# Altium project Papilio_DUO.PrjPcb
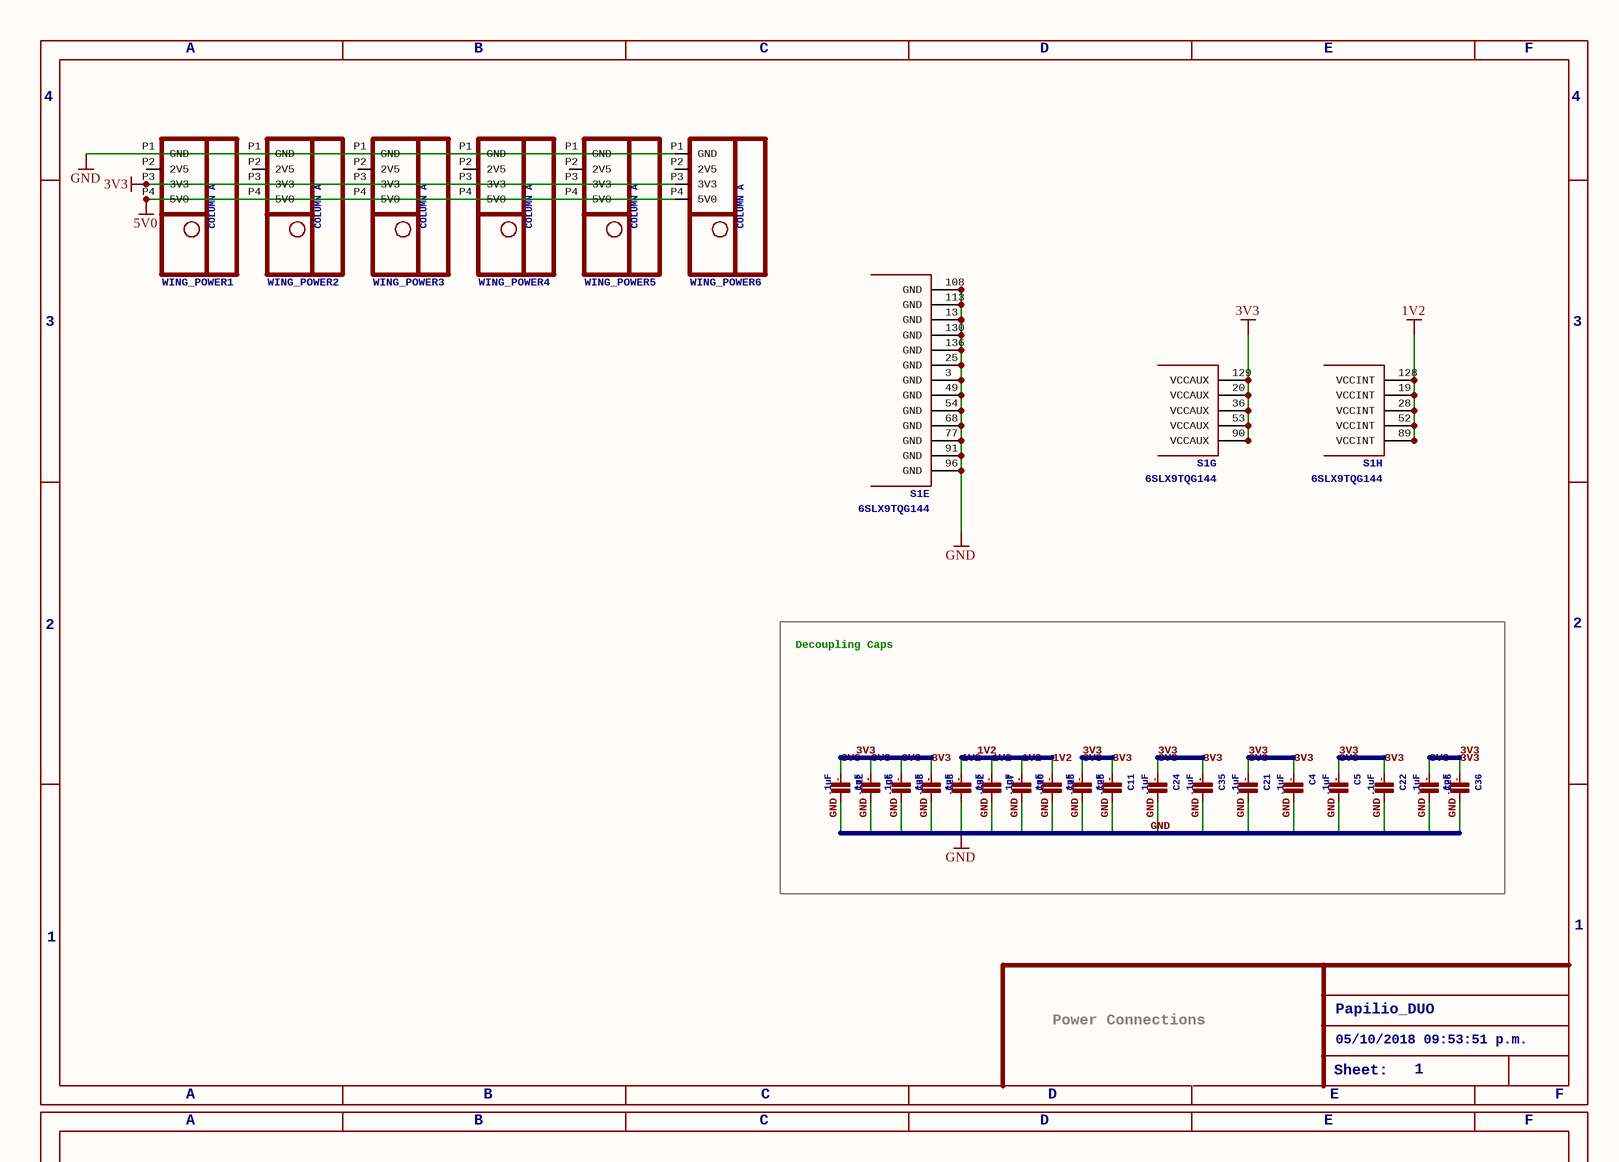
[diagram p0: Papilio_DUO_0.SchDoc, top left]
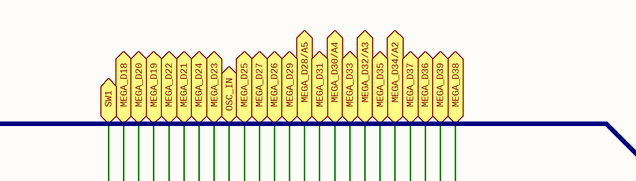
[diagram p1: Papilio_DUO_0.SchDoc, top middle]
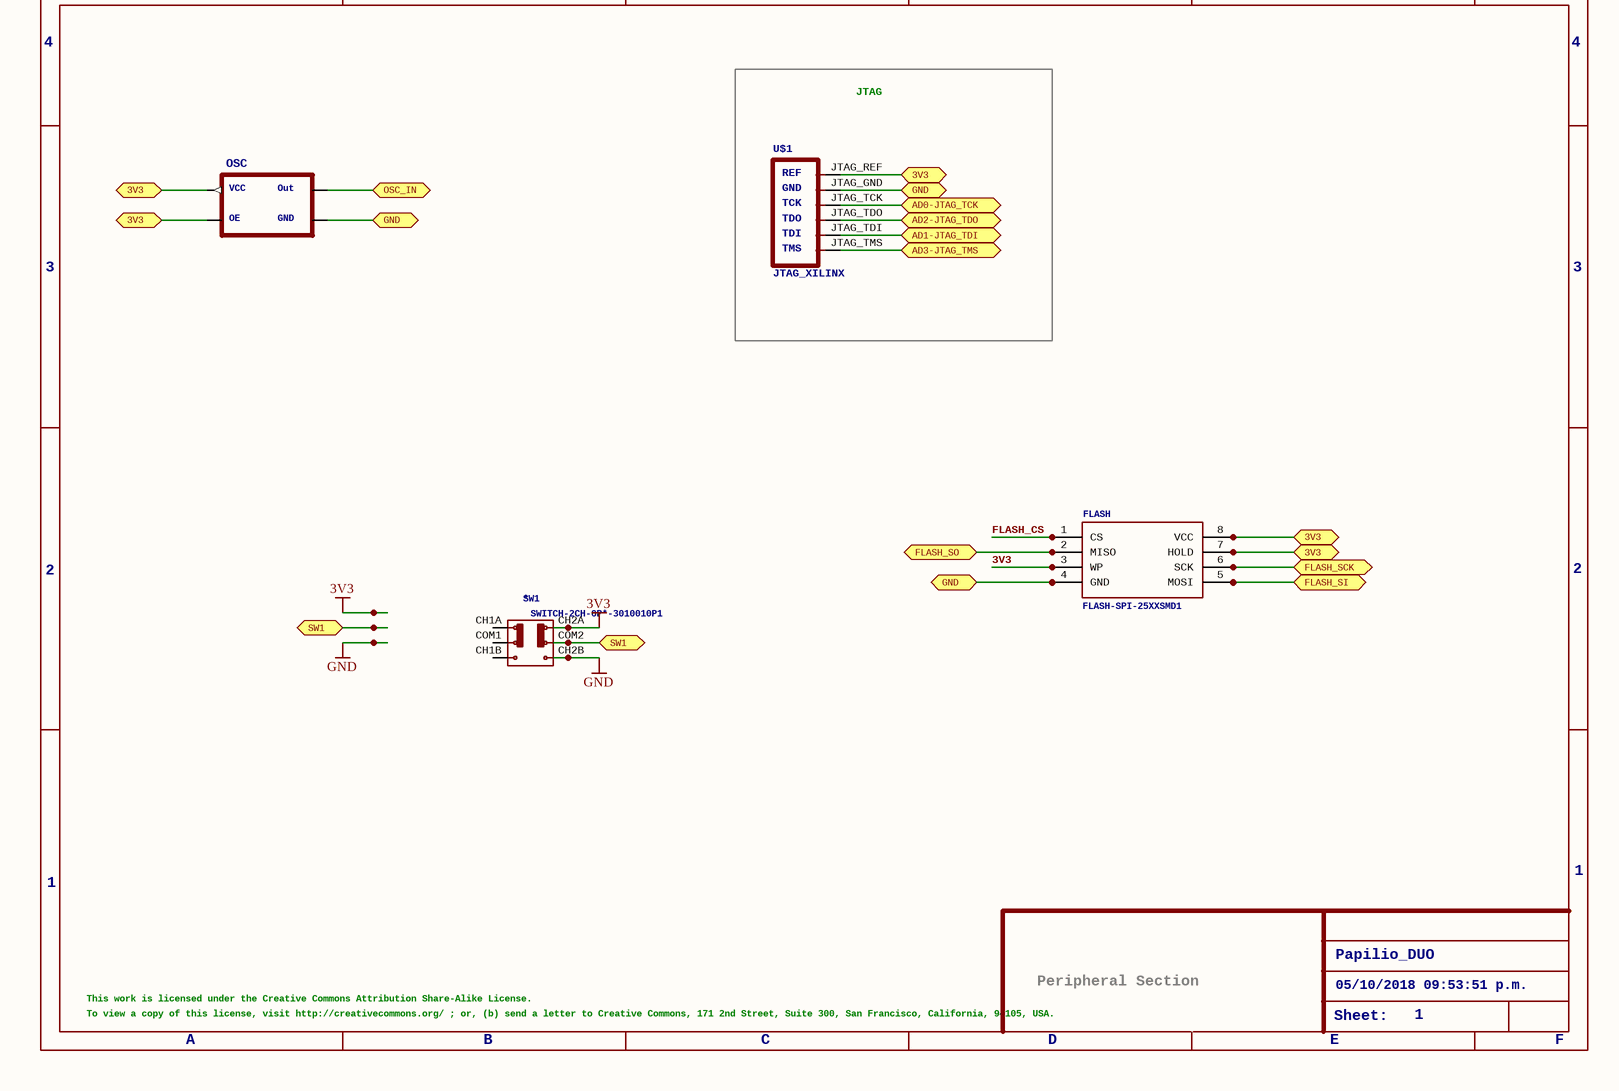
[diagram p2: Papilio_DUO_0.SchDoc, bottom left]
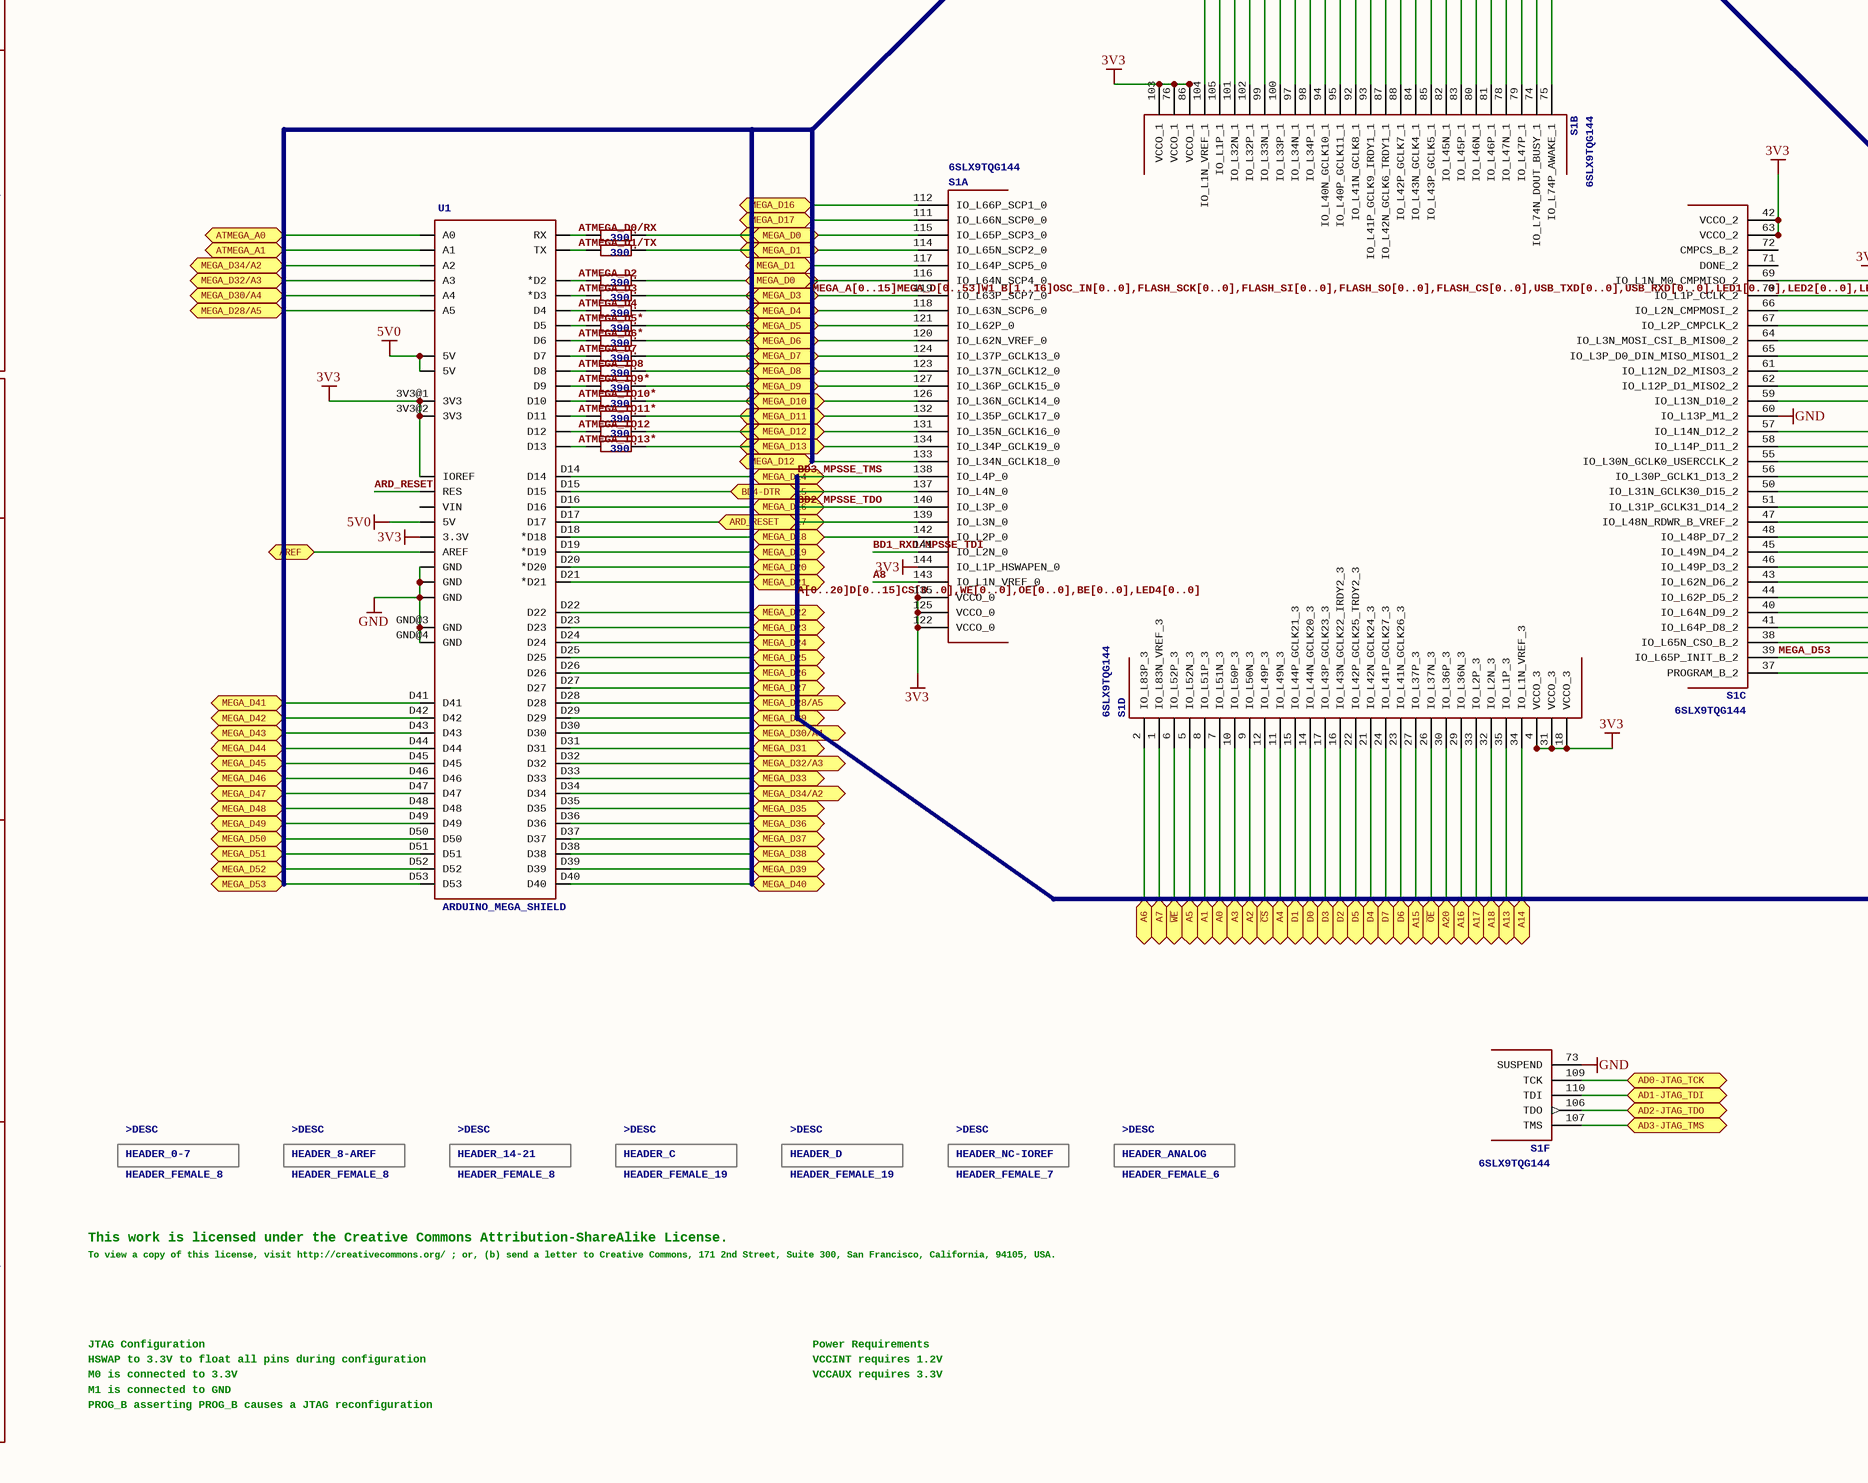
[diagram p3: Papilio_DUO_0.SchDoc, bottom middle]
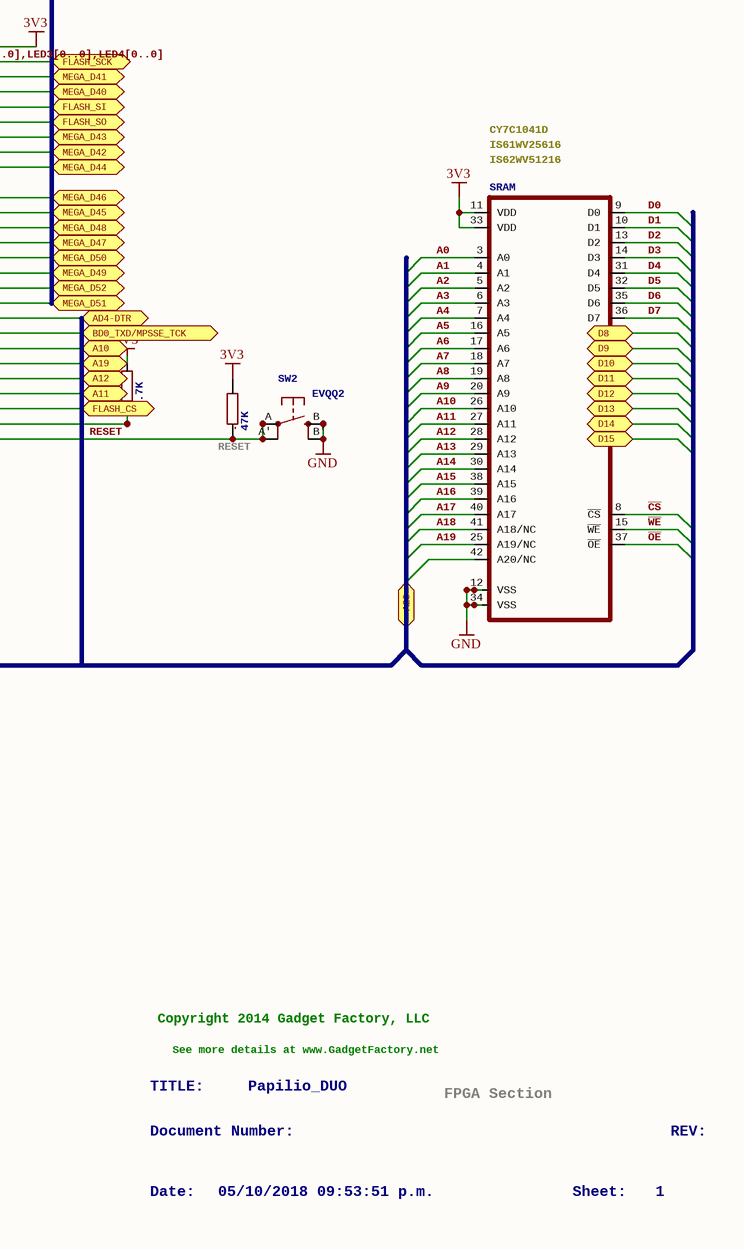
[diagram p4: Papilio_DUO_0.SchDoc, bottom right]
4 sheets, 121 parts. Net scope: flat (ports and power ports of the same name join across sheets).
Board file: Papilio_DUO.PcbDoc
Sheets:
  Papilio_DUO_0.SchDoc
  Papilio_DUO_1.SchDoc
  Papilio_DUO_2.SchDoc
  Papilio_DUO_3.SchDoc

## Sheet Papilio_DUO_0.SchDoc: Papilio_DUO
size 720 x 381 mm; Date: 05/10/2018 09:53:51 p.m.; Organization: INVAP S.E.; Address1: Argentina; Address2: Rio Negro; Address3: Bariloche; Address4: Cte. Luis Piedra Buena 4950; SheetNumber: 1; DATABASE: C:/Dropbox/GadgetFactory/GadgetFactory_Engineering/Libraries/GadgetFactory-PARTSDB.txt; Rule: PcbType=ProtelPcb

### Parts
C4  .1uF  [0603]
C5  .1uF  [0603]
C6  .1uF  [0603]
C7  .1uF  [0603]
C10  .1uF  [0603]
C11  .1uF  [0603]
C12  .1uF  [0603]
C13  .1uF  [0603]
C21  .1uF  [0603]
C22  .1uF  [0603]
C23  .1uF  [0603]
C24  .1uF  [0603]
C25  .1uF  [0603]
C26  .1uF  [0603]
C32  .1uF  [0603]
C33  .1uF  [0603]
C35  .1uF  [0603]
C36  .1uF  [0603]
FLASH  FLASH-SPI-25XXSMD1  [SO08-EIAJ]
FRAME2  DRAWING_NAME: Papilio_DUO  LAST_DATE_TIME: 05/10/2018 09:53:51 p.m.  SHEET: 1  Sheet: Sheet:  (hidden comment: FRAME-A4L-LOC)
FRAME4  DRAWING_NAME: Papilio_DUO  LAST_DATE_TIME: 05/10/2018 09:53:51 p.m.  SHEET: 1  Sheet: Sheet:  (hidden comment: FRAME-A4L-LOC)
HEADER_0-7  HEADER_FEMALE_8  DESC: >DESC
HEADER_8-AREF  HEADER_FEMALE_8  DESC: >DESC
HEADER_14-21  HEADER_FEMALE_8  DESC: >DESC
HEADER_ANALOG  HEADER_FEMALE_6  DESC: >DESC
HEADER_C  HEADER_FEMALE_19  DESC: >DESC
HEADER_D  HEADER_FEMALE_19  DESC: >DESC
HEADER_NC-IOREF  HEADER_FEMALE_7  DESC: >DESC
OSC  OSC1  [OSC1]  (value not drawn)
R8  390  [0603]
R9  390  [0603]
R10  390  [0603]
R11  390  [0603]
R12  390  [0603]
R13  390  [0603]
R14  390  [0603]
R15  390  [0603]
R16  390  [0603]
R17  390  [0603]
R18  390  [0603]
R19  390  [0603]
R20  390  [0603]
R21  390  [0603]
R31  47K  [0805]
R32  4.7K  [0603]
S1  6SLX9TQG144  [TQ144]  (parts A,B,C,D,E,F,G,H of 8)
SRAM  ISSI_SRAM_8BIT  [TSOP44-II]  (value not drawn)
SW1  SWITCH-2CH-6P*-3010010P1  [6P-2CH-2.54-9.1X3.5X3.2+2H]
SW2  EVQQ2  [EVQ-Q2]
U1  ARDUINO_MEGA_SHIELD  [ARDUINO_MEGA_SHIELD]
U$1  JTAG_XILINX  [JTAG]
WING_POWER1  COLUMNA: COLUMN A  [POWER_NO_TEXT]  (hidden comment: HEADER_FEMALE_4)
WING_POWER2  COLUMNA: COLUMN A  [POWER_NO_TEXT]  (hidden comment: HEADER_FEMALE_4)
WING_POWER3  COLUMNA: COLUMN A  [POWER_NO_TEXT]  (hidden comment: HEADER_FEMALE_4)
WING_POWER4  COLUMNA: COLUMN A  [POWER_NO_TEXT]  (hidden comment: HEADER_FEMALE_4)
WING_POWER5  COLUMNA: COLUMN A  [POWER_NO_TEXT]  (hidden comment: HEADER_FEMALE_4)
WING_POWER6  COLUMNA: COLUMN A  [POWER_NO_TEXT]  (hidden comment: HEADER_FEMALE_4)

### Blocks framed on the sheet
Decoupling Caps: C4-C7 C10-C13 C21-C26 C32 C33 C35 C36
JTAG: U$1

### Ports
3V3, A0, A1, A2, A3, A4, A5, A6, A7, A9, A10, A11, A12, A13, A14, A15, A16, A17, A18, A19, A20, AD0-JTAG_TCK, AD1-JTAG_TDI, AD2-JTAG_TDO, AD3-JTAG_TMS, AD4-DTR, ARD_RESET, AREF, ATMEGA_A0, ATMEGA_A1, BD0_TXD/MPSSE_TCK, BD4-DTR, D0, D1, D2, D3, D4, D5, D6, D7, D8, D9, D10, D11, D12, D13, D14, D15, FLASH_CS, FLASH_SCK, FLASH_SI, FLASH_SO, GND, MEGA_D0, MEGA_D1, MEGA_D2, MEGA_D3, MEGA_D4, MEGA_D5, MEGA_D6, MEGA_D7, MEGA_D8, MEGA_D9, MEGA_D10, MEGA_D11, MEGA_D12, MEGA_D13, MEGA_D14, MEGA_D15, MEGA_D16, MEGA_D17, MEGA_D18, MEGA_D19, MEGA_D20, MEGA_D21, MEGA_D22, MEGA_D23, MEGA_D24, MEGA_D25, MEGA_D26, MEGA_D27, MEGA_D28/A5, MEGA_D29, MEGA_D30/A4, MEGA_D31, MEGA_D32/A3, MEGA_D33, MEGA_D34/A2, MEGA_D35, MEGA_D36, MEGA_D37, MEGA_D38, MEGA_D39, MEGA_D40, MEGA_D41, MEGA_D42, MEGA_D43, MEGA_D44, MEGA_D45, MEGA_D46, MEGA_D47, MEGA_D48, MEGA_D49, MEGA_D50, MEGA_D51, MEGA_D52, MEGA_D53, OSC_IN, SW1, ~{CS}, ~{OE}, ~{WE}

### Nets
1V2: C7.1 C10.1 C13.1 C32.1 S1.19(VCCINT) S1.28(VCCINT) S1.52(VCCINT) S1.89(VCCINT) S1.128(VCCINT)
3V3: C4.1 C5.1 C6.1 C11.1 C12.1 C21.1 C22.1 C23.1 C24.1 C25.1 C26.1 C33.1 C35.1 C36.1 FLASH.3(WP) R31.2 R32.2 S1.4(VCCO_3) S1.18(VCCO_3) S1.20(VCCAUX) S1.31(VCCO_3) S1.36(VCCAUX) S1.42(VCCO_2) S1.44(IO_L62P_D5_2) S1.53(VCCAUX) S1.63(VCCO_2) S1.69(IO_L1N_M0_CMPMISO_2) S1.76(VCCO_1) S1.86(VCCO_1) S1.90(VCCAUX) S1.103(VCCO_1) S1.122(VCCO_0) S1.125(VCCO_0) S1.129(VCCAUX) S1.135(VCCO_0) S1.144(IO_L1P_HSWAPEN_0) SRAM.11(VDD) SRAM.33(VDD) SW1.CH2A U1.3.3V U1.3V3@1(3V3) U1.3V3@2(3V3) U1.IOREF WING_POWER1.P3(3V3) WING_POWER2.P3(3V3) WING_POWER3.P3(3V3) WING_POWER4.P3(3V3) WING_POWER5.P3(3V3) WING_POWER6.P3(3V3) ; port A19
5V0: U1.5V@0(5V) U1.5V@1(5V) U1.5V@2(5V) WING_POWER1.P4(5V0) WING_POWER2.P4(5V0) WING_POWER3.P4(5V0) WING_POWER4.P4(5V0) WING_POWER5.P4(5V0) WING_POWER6.P4(5V0)
GND: C4.2 C5.2 C6.2 C7.2 C10.2 C11.2 C12.2 C13.2 C21.2 C22.2 C23.2 C24.2 C25.2 C26.2 C32.2 C33.2 C35.2 C36.2 FLASH.4(GND) OSC.2@2(GND) S1.3(GND) S1.13(GND) S1.25(GND) S1.49(GND) S1.54(GND) S1.60(IO_L13P_M1_2) S1.68(GND) S1.73(SUSPEND) S1.77(GND) S1.91(GND) S1.96(GND) S1.108(GND) S1.113(GND) S1.130(GND) S1.136(GND) SRAM.12(VSS) SRAM.34(VSS) SW1.CH2B SW2.B(S) SW2.B'(S1) U1.GND@0(GND) U1.GND@1(GND) U1.GND@2(GND) U1.GND@3(GND) U1.GND@4(GND) U$1.JTAG_GND WING_POWER1.P1(GND) WING_POWER2.P1(GND) WING_POWER3.P1(GND) WING_POWER4.P1(GND) WING_POWER5.P1(GND) WING_POWER6.P1(GND) ; port GND
A0: SRAM.3(A0)
A1: SRAM.4(A1)
A2: SRAM.5(A2)
A3: SRAM.6(A3)
A4: SRAM.7(A4)
A5: SRAM.16(A5)
A6: SRAM.17(A6)
A7: SRAM.18(A7)
A8: S1.143(IO_L1N_VREF_0) SRAM.19(A8)
A9: SRAM.20(A9)
A10: SRAM.26(A10)
A11: SRAM.27(A11)
A12: SRAM.28(A12)
A13: SRAM.29(A13)
A14: SRAM.30(A14)
A15: SRAM.38(A15)
A16: SRAM.39(A16)
A17: SRAM.40(A17)
A18: SRAM.41(A18/NC)
A19: SRAM.25(A19/NC)
ARD_RESET: U1.RES
ATMEGA_D0/RX: R21.2 U1.RX
ATMEGA_D1/TX: R20.2 U1.TX
ATMEGA_D2: R19.2 U1.D2(*D2)
ATMEGA_D3: R18.2 U1.D3(*D3)
ATMEGA_D4: R17.2 U1.D4
ATMEGA_D5*: R16.2 U1.D5
ATMEGA_D6*: R15.2 U1.D6
ATMEGA_D7: R14.2 U1.D7
ATMEGA_IO8: R13.2 U1.D8
ATMEGA_IO9*: R12.2 U1.D9
ATMEGA_IO10*: R11.2 U1.D10
ATMEGA_IO11*: R10.2 U1.D11
ATMEGA_IO12: R9.2 U1.D12
ATMEGA_IO13*: R8.2 U1.D13
BD1_RXD/MPSSE_TDI: S1.141(IO_L2N_0)
BD2_MPSSE_TDO: S1.112(IO_L66P_SCP1_0) S1.140(IO_L3P_0) U1.D16 ; port MEGA_D16
BD3_MPSSE_TMS: R9.1 R11.1 R13.1 R15.1 R17.1 R19.1 R21.1 S1.115(IO_L65P_SCP3_0) S1.116(IO_L64N_SCP4_0) S1.118(IO_L63N_SCP6_0) S1.120(IO_L62N_VREF_0) S1.123(IO_L37N_GCLK12_0) S1.126(IO_L36N_GCLK14_0) S1.131(IO_L35N_GCLK16_0) S1.133(IO_L34N_GCLK18_0) S1.138(IO_L4P_0) U1.D14 ; port MEGA_D2, port MEGA_D4, port MEGA_D6, port MEGA_D8, port MEGA_D10, port MEGA_D12, port MEGA_D14, port MEGA_D0
~{CS}: SRAM.8(~{CS})
D0: SRAM.9(D0)
D1: SRAM.10(D1)
D2: SRAM.13(D2)
D3: SRAM.14(D3)
D4: SRAM.31(D4)
D5: SRAM.32(D5)
D6: SRAM.35(D6)
D7: SRAM.36(D7)
FLASH_CS: FLASH.1(CS)
MEGA_A[0..15]MEGA_D[0..53]W1_B[1..16]OSC_IN[0..0],FLASH_SCK[0..0],FLASH_SI[0..0],FLASH_SO[0..0],FLASH_CS[0..0],USB_TXD[0..0],USB_RXD[0..0],LED1[0..0],LED2[0..0],LED3[0..0],LED4[0..0]: R18.1 S1.119(IO_L63P_SCP7_0) ; port MEGA_D3
MEGA_D53: R32.1 S1.39(IO_L65P_INIT_B_2)
~{OE}: SRAM.37(~{OE})
RESET: R31.1 S1.37(PROGRAM_B_2) SW2.A(P) SW2.A'(P1)
~{WE}: SRAM.15(~{WE})
NetFLASH_2: FLASH.2(MISO) S1.65(IO_L3P_D0_DIN_MISO_MISO1_2) ; port FLASH_SO
NetFLASH_5: FLASH.5(MOSI) S1.64(IO_L3N_MOSI_CSI_B_MISO0_2) ; port FLASH_SI
NetFLASH_6: FLASH.6(SCK) S1.70(IO_L1P_CCLK_2) ; port FLASH_SCK
NetFLASH_7: FLASH.7(HOLD) FLASH.8(VCC) OSC.1@1(OE) OSC.4@4(VCC) U$1.JTAG_REF ; port 3V3
NetIC1_16: S1.109(TCK) U$1.JTAG_TCK ; port AD0-JTAG_TCK
NetIC1_17: S1.110(TDI) U$1.JTAG_TDI ; port AD1-JTAG_TDI
NetIC1_18: S1.106(TDO) U$1.JTAG_TDO ; port AD2-JTAG_TDO
NetIC1_19: S1.107(TMS) U$1.JTAG_TMS ; port AD3-JTAG_TMS
NetIC1_21: S1.45(IO_L49N_D4_2) ; port AD4-DTR
NetIC1_38: S1.46(IO_L49P_D3_2) ; port BD0_TXD/MPSSE_TCK
NetIC1_43: R20.1 S1.114(IO_L65N_SCP2_0) S1.117(IO_L64P_SCP5_0) S1.137(IO_L4N_0) U1.D15 ; port MEGA_D15, port MEGA_D1, port BD4-DTR
NetOSC_3@3: OSC.3@3(OUT) S1.94(IO_L40N_GCLK10_1) ; port OSC_IN
NetR8_1: R8.1 S1.134(IO_L34P_GCLK19_0) ; port MEGA_D13
NetR10_1: R10.1 S1.132(IO_L35P_GCLK17_0) ; port MEGA_D11
NetR12_1: R12.1 S1.127(IO_L36P_GCLK15_0) ; port MEGA_D9
NetR14_1: R14.1 S1.124(IO_L37P_GCLK13_0) ; port MEGA_D7
NetR16_1: R16.1 S1.121(IO_L62P_0) ; port MEGA_D5
NetS1_1: S1.1(IO_L83N_VREF_3) ; port A7
NetS1_2: S1.2(IO_L83P_3) ; port A6
NetS1_5: S1.5(IO_L52N_3) ; port A5
NetS1_6: S1.6(IO_L52P_3) ; port ~{WE}
NetS1_7: S1.7(IO_L51N_3) ; port A0
NetS1_8: S1.8(IO_L51P_3) ; port A1
NetS1_9: S1.9(IO_L50N_3) ; port A2
NetS1_10: S1.10(IO_L50P_3) ; port A3
NetS1_11: S1.11(IO_L49N_3) ; port A4
NetS1_12: S1.12(IO_L49P_3) ; port ~{CS}
NetS1_14: S1.14(IO_L44N_GCLK20_3) ; port D0
NetS1_15: S1.15(IO_L44P_GCLK21_3) ; port D1
NetS1_16: S1.16(IO_L43N_GCLK22_IRDY2_3) ; port D2
NetS1_17: S1.17(IO_L43P_GCLK23_3) ; port D3
NetS1_21: S1.21(IO_L42N_GCLK24_3) ; port D4
NetS1_22: S1.22(IO_L42P_GCLK25_TRDY2_3) ; port D5
NetS1_23: S1.23(IO_L41N_GCLK26_3) ; port D6
NetS1_24: S1.24(IO_L41P_GCLK27_3) ; port D7
NetS1_26: S1.26(IO_L37N_3) ; port ~{OE}
NetS1_27: S1.27(IO_L37P_3) ; port A15
NetS1_29: S1.29(IO_L36N_3) ; port A16
NetS1_30: S1.30(IO_L36P_3) SRAM.42(A20/NC) ; port A20
NetS1_32: S1.32(IO_L2N_3) ; port A18
NetS1_33: S1.33(IO_L2P_3) ; port A17
NetS1_34: S1.34(IO_L1N_VREF_3) ; port A14
NetS1_35: S1.35(IO_L1P_3) ; port A13
NetS1_38: S1.38(IO_L65N_CSO_B_2) ; port FLASH_CS
NetS1_40: S1.40(IO_L64N_D9_2) ; port A12
NetS1_41: S1.41(IO_L64P_D8_2) ; port A11
NetS1_43: S1.43(IO_L62N_D6_2) ; port A10
NetS1_47: S1.47(IO_L48N_RDWR_B_VREF_2) U1.D52 ; port MEGA_D52
NetS1_48: S1.48(IO_L48P_D7_2) U1.D51 ; port MEGA_D51
NetS1_50: S1.50(IO_L31N_GCLK30_D15_2) U1.D50 ; port MEGA_D50
NetS1_51: S1.51(IO_L31P_GCLK31_D14_2) U1.D49 ; port MEGA_D49
NetS1_55: S1.55(IO_L30N_GCLK0_USERCCLK_2) U1.D48 ; port MEGA_D48
NetS1_56: S1.56(IO_L30P_GCLK1_D13_2) U1.D47 ; port MEGA_D47
NetS1_57: S1.57(IO_L14N_D12_2) U1.D46 ; port MEGA_D46
NetS1_58: S1.58(IO_L14P_D11_2) U1.D45 ; port MEGA_D45
NetS1_59: S1.59(IO_L13N_D10_2) U1.D44 ; port MEGA_D44
NetS1_61: S1.61(IO_L12N_D2_MISO3_2) U1.D43 ; port MEGA_D43
NetS1_62: S1.62(IO_L12P_D1_MISO2_2) U1.D42 ; port MEGA_D42
NetS1_66: S1.66(IO_L2N_CMPMOSI_2) U1.D41 ; port MEGA_D41
NetS1_67: S1.67(IO_L2P_CMPCLK_2) U1.D40 ; port MEGA_D40
NetS1_74: S1.74(IO_L74N_DOUT_BUSY_1) U1.D39 ; port MEGA_D39
NetS1_75: S1.75(IO_L74P_AWAKE_1) U1.D38 ; port MEGA_D38
NetS1_78: S1.78(IO_L47N_1) U1.D37 ; port MEGA_D37
NetS1_79: S1.79(IO_L47P_1) U1.D36 ; port MEGA_D36
NetS1_80: S1.80(IO_L46N_1) U1.D35 ; port MEGA_D35
NetS1_81: S1.81(IO_L46P_1) U1.A2 U1.D34 ; port MEGA_D34/A2
NetS1_82: S1.82(IO_L45N_1) U1.D33 ; port MEGA_D33
NetS1_83: S1.83(IO_L45P_1) U1.A3 U1.D32 ; port MEGA_D32/A3
NetS1_84: S1.84(IO_L43N_GCLK4_1) U1.D31 ; port MEGA_D31
NetS1_85: S1.85(IO_L43P_GCLK5_1) U1.A4 U1.D30 ; port MEGA_D30/A4
NetS1_87: S1.87(IO_L42N_GCLK6_TRDY1_1) U1.D29 ; port MEGA_D29
NetS1_88: S1.88(IO_L42P_GCLK7_1) U1.A5 U1.D28 ; port MEGA_D28/A5
NetS1_92: S1.92(IO_L41N_GCLK8_1) U1.D27 ; port MEGA_D27
NetS1_93: S1.93(IO_L41P_GCLK9_IRDY1_1) U1.D26 ; port MEGA_D26
NetS1_95: S1.95(IO_L40P_GCLK11_1) U1.D25 ; port MEGA_D25
NetS1_97: S1.97(IO_L34N_1) U1.D24 ; port MEGA_D24
NetS1_98: S1.98(IO_L34P_1) U1.D23 ; port MEGA_D23
NetS1_99: S1.99(IO_L33N_1) U1.D22 ; port MEGA_D22
NetS1_100: S1.100(IO_L33P_1) U1.D21(*D21) ; port MEGA_D21
NetS1_101: S1.101(IO_L32N_1) U1.D20(*D20) ; port MEGA_D20
NetS1_102: S1.102(IO_L32P_1) U1.D19(*D19) ; port MEGA_D19
NetS1_104: S1.104(IO_L1N_VREF_1) SW1.COM2 ; port SW1
NetS1_105: S1.105(IO_L1P_1) S1.142(IO_L2P_0) U1.D18(*D18) ; port A9, port MEGA_D18
NetS1_111: S1.111(IO_L66N_SCP0_0) S1.139(IO_L3N_0) U1.D17 ; port MEGA_D17, port ARD_RESET
NetU1_A0: U1.A0 ; port ATMEGA_A0
NetU1_A1: U1.A1 ; port ATMEGA_A1
NetU1_AREF: U1.AREF ; port AREF
NetU1_D53: U1.D53 ; port MEGA_D53

Not connected (* = marked no-connect by the designer): S1 71(DONE_2) 72(CMPCS_B_2); SW1 CH1A CH1B COM1; U1 VIN; WING_POWER1 P2(2V5); WING_POWER2 P2(2V5); WING_POWER3 P2(2V5); WING_POWER4 P2(2V5); WING_POWER5 P2(2V5); WING_POWER6 P2(2V5)

### Buses and harness runs
bus 1V2
bus 3V3
bus A[0..20]D[0..15]CS[0..0],WE[0..0],OE[0..0],BE[0..0],LED4[0..0]
bus GND

### Notes on the sheet
- Power Connections
- (near SRAM) IS62WV51216
- IS61WV25616
- CY7C1041D
- (near R31) RESET
- This work is licensed under the Creative Commons Attribution-ShareAlike License.
- To view a copy of this license, visit http://creativecommons.org/ ; or, (b) send a letter to Creative Commons, 171 2nd Street, Suite 300, San Francisco, California, 94105, USA.
- Copyright 2014 Gadget Factory, LLC
- See more details at www.GadgetFactory.net
- Peripheral Section
- JTAG Configuration
- HSWAP to 3.3V to float all pins during configuration
- M0 is connected to 3.3V
- Power Requirements
- VCCINT requires 1.2V
- VCCAUX requires 3.3V
- TITLE:
- Document Number:
- Papilio_DUO
- FPGA Section
- REV:
- This work is licensed under the Creative Commons Attribution Share-Alike License.
- (near FRAME2) To view a copy of this license, visit http://creativecommons.org/ ; or, (b) send a letter to Creative Commons, 171 2nd Street, Suite 300, San Francisco, California, 94105, USA.
- M1 is connected to GND
- PROG_B asserting PROG_B causes a JTAG reconfiguration
- Date:
- 05/10/2018 09:53:51 p.m.
- Sheet:
- 1
- 2
- 3
- 4
- 5
- 6
- 7
- 8
- 9
- A
- B
- C
- D
- E
- Título:
- F
- Nº
- Hoja:
- de:
- Escala:
- *

### Library data of the parts
C4-C7 C10-C13 C21-C26 C32 C33 C35 C36 = C0603: CAPACITOR, European symbol; PARTNO: *
FLASH = FLASH-SPI-25XXSMD1: SPI Flash; PARTNO: *
FRAME2 FRAME4 = FRAME-A4L-LOC: FRAME   DIN A4, landscape with location and doc. field; A: A; B: B; C: C; D: D; E: E; F: F; 1: 1; 2: 2; 3: 3; 4: 4
HEADER_0-7 HEADER_8-AREF HEADER_14-21 = BOM-PART: BOM ENTRY   Special BOM entry-only specifier field.; PARTNO: PPTC081LFBN-RC; BOM: INCLUDE; QTY: 1
HEADER_ANALOG = BOM-PART: BOM ENTRY   Special BOM entry-only specifier field.; PARTNO: PPTC061LFBN-RC; BOM: INCLUDE; QTY: 1
HEADER_C HEADER_D = BOM-PART: BOM ENTRY   Special BOM entry-only specifier field.; PARTNO: PPTC191LFBN-RC; BOM: INCLUDE; QTY: 1
HEADER_NC-IOREF = BOM-PART: BOM ENTRY   Special BOM entry-only specifier field.; PARTNO: PPTC071LFBN-RC; BOM: INCLUDE; QTY: 1
R8-R21 R32 = R0603: RESISTOR, European symbol; PARTNO: *
R31 = R0805: RESISTOR, European symbol; PARTNO: *
S1 = 6SLX9TQG144: Xilinx FPGA: 6SLX9TQG144; PARTNO: *
SW1 = SWITCH-2CH-6P*-3010010P1: MS-22D18 G2 ROHS; NAME: *; PARTNO: *
SW2 = EVQQ2: SMT 6mm switch, EVQQ2 series    http://www.ladyada.net/library/eagle; PARTNO: *
WING_POWER1-WING_POWER6 = POWER_ONLYNOTEXT: PARTNO: *
OSC = OSC1: PARTNO: *; OE: OE; GND: GND; VCC: VCC; Out: Out
SRAM = ISSI_SRAM_8BIT: PARTNO: *
U1 = ARDUINO_MEGA_SHIELD: BOM: *
U$1 = JTAG_XILINX: BOM: *; REF: REF; GND: GND; TCK: TCK; TDO: TDO; TDI: TDI; TMS: TMS

## Sheet Papilio_DUO_1.SchDoc: Papilio_DUO
size 270 x 207 mm; Date: 05/10/2018 09:53:54 p.m.; Organization: INVAP S.E.; Address1: Argentina; Address2: Rio Negro; Address3: Bariloche; Address4: Cte. Luis Piedra Buena 4950; SheetNumber: 2; DATABASE: C:/Dropbox/GadgetFactory/GadgetFactory_Engineering/Libraries/GadgetFactory-PARTSDB.txt; Rule: PcbType=ProtelPcb
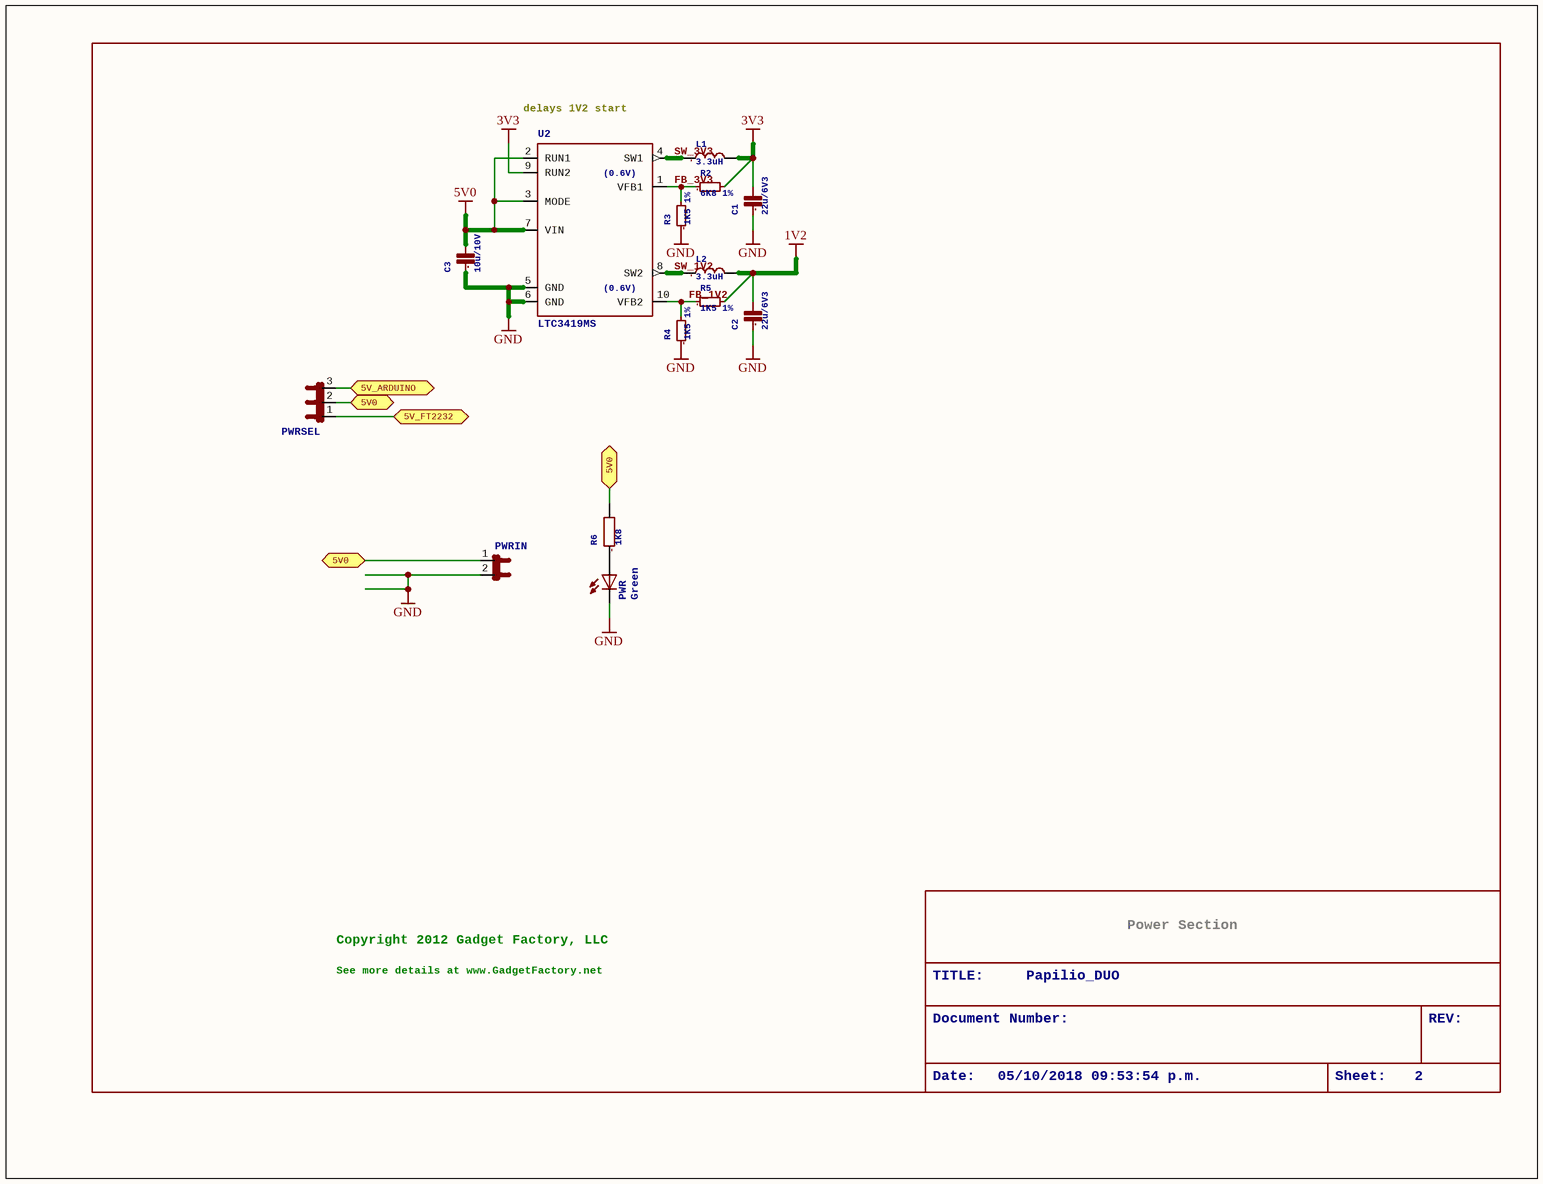
[diagram p5: Papilio_DUO_1.SchDoc]

### Parts
C1  22u/6V3  [0805]
C2  22u/6V3  [0805]
C3  10u/10V  [0805]
L1  3.3uH  [VLS3015]
L2  3.3uH  [VLS3015]
PWR  Green  [CHIP-LED0805]
PWRIN  JP1E  [JP1]  (value not drawn)
PWRSEL  JP2E  [JP2]  (value not drawn)
R2  6K8 1%  [0603]
R3  1K5 1%  [0603]
R4  1K5 1%  [0603]
R5  1K5 1%  [0603]
R6  1K8  [0603]
U2  LTC3419MS  [MSOP10]

### Ports
5V0, 5V_ARDUINO, 5V_FT2232

### Nets
1V2: C2.2 L2.2 R5.2
3V3: C1.2 L1.2 R2.2 U2.9(RUN2)
5V0: C3.2 U2.2(RUN1) U2.3(MODE) U2.7(VIN)
GND: C1.1 C2.1 C3.1 PWR.C PWRIN.2 R3.1 R4.1 U2.5(GND) U2.6(GND)
FB_1V2: R4.2 R5.1 U2.10(VFB2)
FB_3V3: R2.1 R3.2 U2.1(VFB1)
SW_1V2: L2.1 U2.8(SW2)
SW_3V3: L1.1 U2.4(SW1)
NetFPGAUSB_VUSB: PWRSEL.1 ; port 5V_FT2232
NetPWR_A: PWR.A R6.1
NetPWRIN_1: PWRIN.1 PWRSEL.2 R6.2 ; port 5V0
NetPWRSEL_3: PWRSEL.3 ; port 5V_ARDUINO

### Notes on the sheet
- (near U2) delays 1V2 start
- Copyright 2012 Gadget Factory, LLC
- See more details at www.GadgetFactory.net
- TITLE:
- Papilio_DUO
- Power Section
- Document Number:
- REV:
- Date:
- 05/10/2018 09:53:54 p.m.
- Sheet:
- 2
- Título:
- Nº
- Hoja:
- de:
- Escala:
- *

### Library data of the parts
C1-C3 = C0805: CAPACITOR, European symbol; PARTNO: *
L1 L2 = L_VLS3015: INDUCTOR, European symbol; PARTNO: *
PWR = LEDCHIP-LED0805: LED   OSRAM: - CHIPLED LG R971, LG N971, LY N971, LG Q971, LY Q971, LO R971, LY R971 LH N974, LH R974 LS Q976, LO Q976, LY Q976 LO Q996 - Hyper CHIPLED LW Q18S LB Q993, LB Q99A, LB R99A - SideLED LS A670, LO A670, LY A670, LG A670, LP A670 LB A673, LV A673, LT A673, LW A673 LH A674 LY A675 LS A676, LA A676, LO A676, LY A676, LW A676 LS A679, LY A679, LG A679 -  Hyper Micro SIDELEDï¿½ LS Y876, LA Y876, LO Y876, LY Y876 LT Y87S - SmartLED LW L88C, LW L88S LB L89C, LB L89S, LG L890 LS L89K, LO L89K, LY L89K LS L896, LA L896, LO L896, LY L896 - TOPLED LS T670, LO T670, LY T670, LG T670, LP T670 LSG T670, LSP T670, LSY T670, LOP T670, LYG T670 LG T671, LOG T671, LSG T671 LB T673, LV T673, LT T673, LW T673 LH T674 LS T676, LA T676, LO T676, LY T676, LB T676, LH T676, LSB T676, LW T676 LB T67C, LV T67C, LT T67C, LS T67K, LO T67K, LY T67K, LW E67C LS E67B, LA E67B, LO E67B, LY E67B, LB E67C, LV E67C, LT E67C LW T67C LS T679, LY T679, LG T679 LS T770, LO T770, LY T770, LG T770, LP T770 LB T773, LV T773, LT T773, LW T773 LH T774 LS E675, LA E675, LY E675, LS T675 LS T776, LA T776, LO T776, LY T776, LB T776 LHGB T686 LT T68C, LB T68C - Hyper Mini TOPLEDï¿½ LB M676 - Mini TOPLED Santanaï¿½ LG M470 LS M47K, LO M47K, LY M47K    Source: http://www.osram.convergy.de   LUXEON: - LUMILEDï¿½ LXK2-PW12-R00, LXK2-PW12-S00, LXK2-PW14-U00, LXK2-PW14-V00 LXK2-PM12-R00, LXK2-PM12-S00, LXK2-PM14-U00 LXK2-PE12-Q00, LXK2-PE12-R00, LXK2-PE12-S00, LXK2-PE14-T00, LXK2-PE14-U00 LXK2-PB12-K00, LXK2-PB12-L00, LXK2-PB12-M00, LXK2-PB14-N00, LXK2-PB14-P00, LXK2-PB14-Q00 LXK2-PR12-L00, LXK2-PR12-M00, LXK2-PR14-Q00, LXK2-PR14-R00 LXK2-PD12-Q00, LXK2-PD12-R00, LXK2-PD12-S00 LXK2-PH12-R00, LXK2-PH12-S00 LXK2-PL12-P00, LXK2-PL12-Q00, LXK2-PL12-R00    Source: www.luxeon.com   KINGBRIGHT:   KA-3528ASYC Source: www.kingbright.com; PARTNO: *
PWRIN = JP1E: JUMPER; PARTNO: *
PWRSEL = JP2E: JUMPER; PARTNO: *
R2-R5 = R-SMALL0603: PARTNO: *
R6 = R0603: RESISTOR, European symbol; PARTNO: *
U2 = LTC3419MS: Dual Monolithic 600mA Synchronous Step-Down Regulator; PARTNO: *; (0.6V): (0.6V)

## Sheet Papilio_DUO_2.SchDoc: Papilio_DUO
size 270 x 207 mm; Date: 05/10/2018 09:53:56 p.m.; Organization: INVAP S.E.; Address1: Argentina; Address2: Rio Negro; Address3: Bariloche; Address4: Cte. Luis Piedra Buena 4950; SheetNumber: 3; DATABASE: C:/Dropbox/GadgetFactory/GadgetFactory_Engineering/Libraries/GadgetFactory-PARTSDB.txt; Rule: PcbType=ProtelPcb
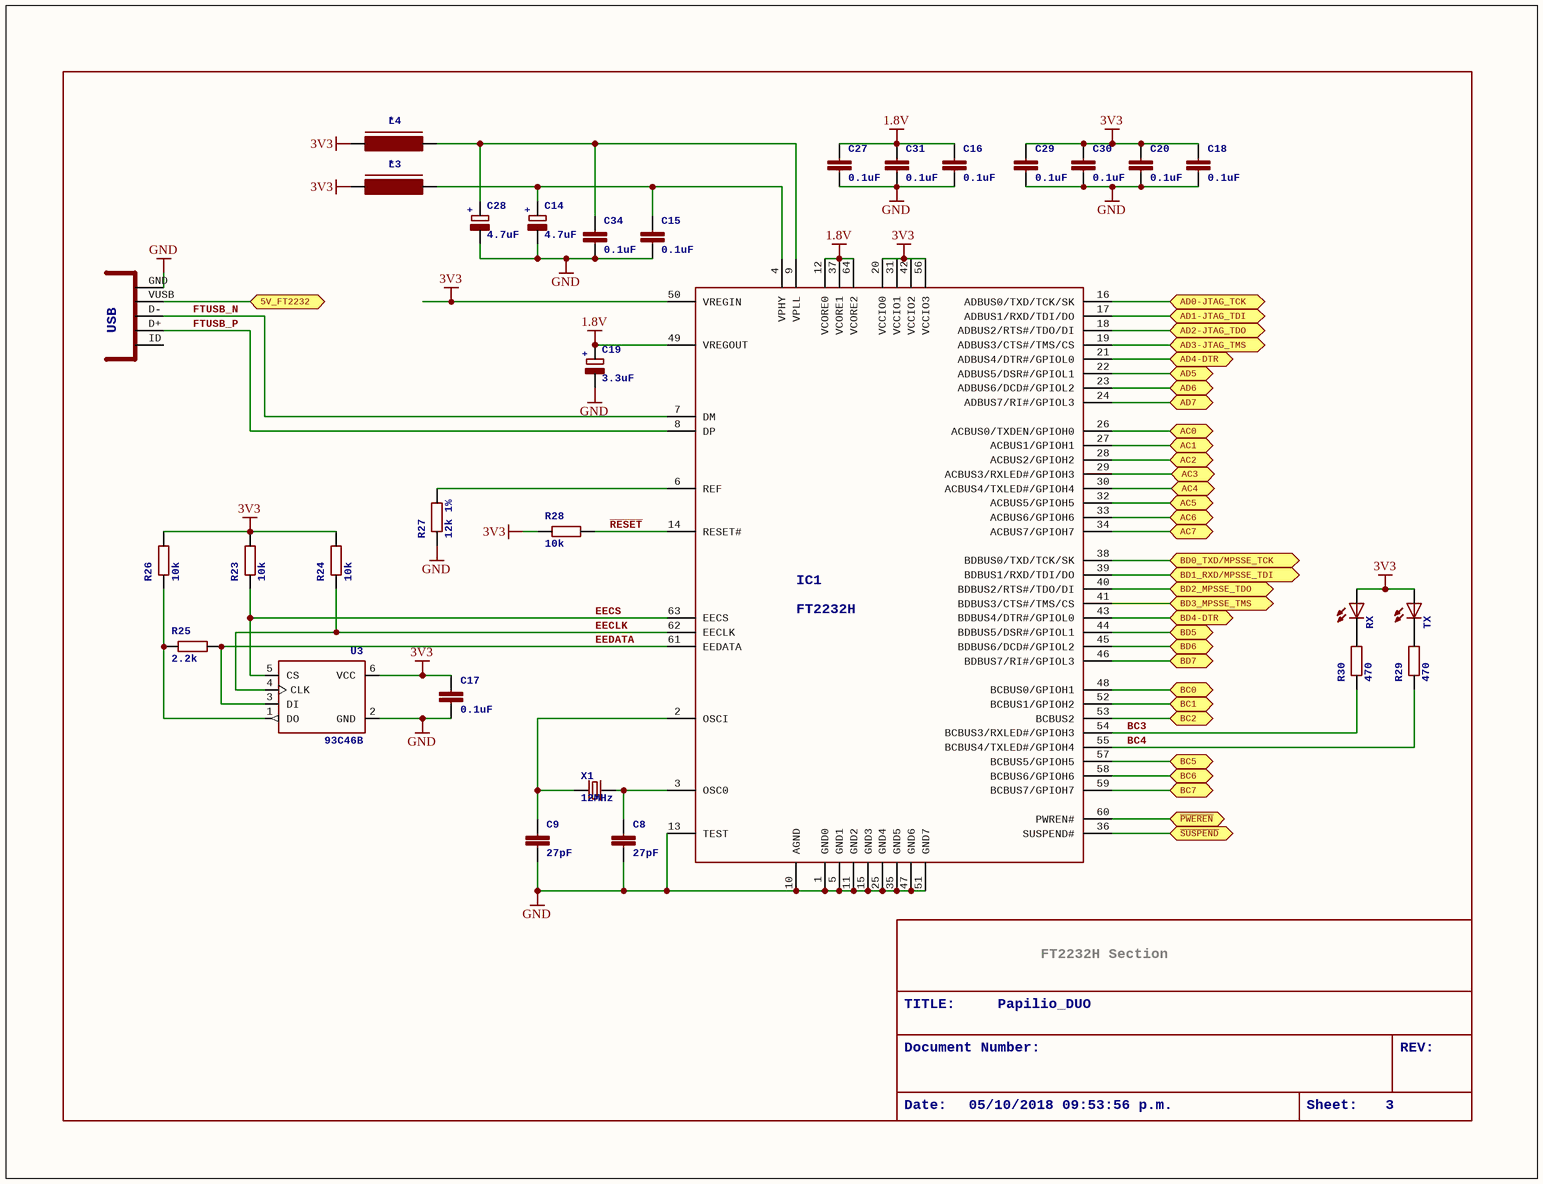
[diagram p6: Papilio_DUO_2.SchDoc]

### Parts
C8  27pF  [C603]
C9  27pF  [C603]
C14  4.7uF  [SMC_A]
C15  0.1uF  [C603]
C16  0.1uF  [C603]
C17  0.1uF  [C603]
C18  0.1uF  [C603]
C19  3.3uF  [SMC_A]
C20  0.1uF  [C603]
C27  0.1uF  [C603]
C28  4.7uF  [SMC_A]
C29  0.1uF  [C603]
C30  0.1uF  [C603]
C31  0.1uF  [C603]
C34  0.1uF  [C603]
FPGAUSB  CONN_USB  [CONN_USB_MINI-B]  (value not drawn)
IC1  FT2232H  [LQFP64]
L3  FERRITE_BEAD603  [FB603]  (value not drawn)
L4  FERRITE_BEAD603  [FB603]  (value not drawn)
R23  10k  [R603]
R24  10k  [R603]
R25  2.2k  [R603]
R26  10k  [R603]
R27  12k 1%  [R603]
R28  10k  [R603]
R29  470  [R603]
R30  470  [R603]
RX  LED805  [LED-805]  (value not drawn)
TX  LED805  [LED-805]  (value not drawn)
U3  93C46B  [SOT23-6]
X1  12MHz  [4X6]

### Ports
5V_FT2232, AC0, AC1, AC2, AC3, AC4, AC5, AC6, AC7, AD0-JTAG_TCK, AD1-JTAG_TDI, AD2-JTAG_TDO, AD3-JTAG_TMS, AD4-DTR, AD5, AD6, AD7, BC0, BC1, BC2, BC5, BC6, BC7, BD0_TXD/MPSSE_TCK, BD1_RXD/MPSSE_TDI, BD2_MPSSE_TDO, BD3_MPSSE_TMS, BD4-DTR, BD5, BD6, BD7, ~{PWEREN}, ~{SUSPEND}

### Nets
1.8V: C16.1 C19.+ C27.1 C31.1 IC1.12(VCORE0) IC1.37(VCORE1) IC1.49(VREGOUT) IC1.64(VCORE2)
3V3: C17.1 C18.1 C20.1 C29.1 C30.1 IC1.20(VCCIO0) IC1.31(VCCIO1) IC1.42(VCCIO2) IC1.50(VREGIN) IC1.56(VCCIO3) L3.2 L4.2 R23.2 R24.2 R26.2 R28.1 RX.A TX.A U3.6(VCC)
GND: C8.2 C9.2 C14.- C15.2 C16.2 C17.2 C18.2 C19.- C20.2 C27.2 C28.- C29.2 C30.2 C31.2 C34.2 FPGAUSB.GND IC1.1(GND0) IC1.5(GND1) IC1.10(AGND) IC1.11(GND2) IC1.13(TEST) IC1.15(GND3) IC1.25(GND4) IC1.35(GND5) IC1.47(GND6) IC1.51(GND7) R27.1 U3.2(GND)
BC3: IC1.54(BCBUS3/RXLED#/GPIOH3) R30.1
BC4: IC1.55(BCBUS4/TXLED#/GPIOH4) R29.1
EECLK: IC1.62(EECLK) R24.1 U3.4(CLK)
EECS: IC1.63(EECS) R23.1 U3.5(CS)
EEDATA: IC1.61(EEDATA) R25.2 U3.3(DI)
FTUSB_N: FPGAUSB.D- IC1.7(DM)
FTUSB_P: FPGAUSB.D+ IC1.8(DP)
~{RESET}: IC1.14(RESET#) R28.2
NetC8_1: C8.1 IC1.3(OSC0) X1.2(X2)
NetC9_1: C9.1 IC1.2(OSCI) X1.1(X1)
NetC14_+: C14.+ C15.1 IC1.4(VPHY) L3.1
NetC28_+: C28.+ C34.1 IC1.9(VPLL) L4.1
NetFPGAUSB_VUSB: FPGAUSB.VUSB ; port 5V_FT2232
NetIC1_6: IC1.6(REF) R27.2
NetIC1_16: IC1.16(ADBUS0/TXD/TCK/SK) ; port AD0-JTAG_TCK
NetIC1_17: IC1.17(ADBUS1/RXD/TDI/DO) ; port AD1-JTAG_TDI
NetIC1_18: IC1.18(ADBUS2/RTS#/TDO/DI) ; port AD2-JTAG_TDO
NetIC1_19: IC1.19(ADBUS3/CTS#/TMS/CS) ; port AD3-JTAG_TMS
NetIC1_21: IC1.21(ADBUS4/DTR#/GPIOL0) ; port AD4-DTR
NetIC1_22: IC1.22(ADBUS5/DSR#/GPIOL1) ; port AD5
NetIC1_23: IC1.23(ADBUS6/DCD#/GPIOL2) ; port AD6
NetIC1_24: IC1.24(ADBUS7/RI#/GPIOL3) ; port AD7
NetIC1_26: IC1.26(ACBUS0/TXDEN/GPIOH0) ; port AC0
NetIC1_27: IC1.27(ACBUS1/GPIOH1) ; port AC1
NetIC1_28: IC1.28(ACBUS2/GPIOH2) ; port AC2
NetIC1_29: IC1.29(ACBUS3/RXLED#/GPIOH3) ; port AC3
NetIC1_30: IC1.30(ACBUS4/TXLED#/GPIOH4) ; port AC4
NetIC1_32: IC1.32(ACBUS5/GPIOH5) ; port AC5
NetIC1_33: IC1.33(ACBUS6/GPIOH6) ; port AC6
NetIC1_34: IC1.34(ACBUS7/GPIOH7) ; port AC7
NetIC1_36: IC1.36(SUSPEND#) ; port ~{SUSPEND}
NetIC1_38: IC1.38(BDBUS0/TXD/TCK/SK) ; port BD0_TXD/MPSSE_TCK
NetIC1_39: IC1.39(BDBUS1/RXD/TDI/DO) ; port BD1_RXD/MPSSE_TDI
NetIC1_40: IC1.40(BDBUS2/RTS#/TDO/DI) ; port BD2_MPSSE_TDO
NetIC1_41: IC1.41(BDBUS3/CTS#/TMS/CS) ; port BD3_MPSSE_TMS
NetIC1_43: IC1.43(BDBUS4/DTR#/GPIOL0) ; port BD4-DTR
NetIC1_44: IC1.44(BDBUS5/DSR#/GPIOL1) ; port BD5
NetIC1_45: IC1.45(BDBUS6/DCD#/GPIOL2) ; port BD6
NetIC1_46: IC1.46(BDBUS7/RI#/GPIOL3) ; port BD7
NetIC1_48: IC1.48(BCBUS0/GPIOH1) ; port BC0
NetIC1_52: IC1.52(BCBUS1/GPIOH2) ; port BC1
NetIC1_53: IC1.53(BCBUS2) ; port BC2
NetIC1_57: IC1.57(BCBUS5/GPIOH5) ; port BC5
NetIC1_58: IC1.58(BCBUS6/GPIOH6) ; port BC6
NetIC1_59: IC1.59(BCBUS7/GPIOH7) ; port BC7
NetIC1_60: IC1.60(PWREN#) ; port ~{PWEREN}
NetR25_1: R25.1 R26.1 U3.1(DO)
NetR29_2: R29.2 TX.C
NetR30_2: R30.2 RX.C

Not connected (* = marked no-connect by the designer): FPGAUSB ID(USBID)

### Notes on the sheet
- FT2232H Section
- TITLE:
- Document Number:
- Papilio_DUO
- REV:
- Date:
- 05/10/2018 09:53:56 p.m.
- Sheet:
- 3
- Título:
- Nº
- Hoja:
- de:
- Escala:
- *

### Library data of the parts
C8 C9 C15-C18 C20 C27 C29-C31 C34 = CAPC603: PARTNO: *
C14 C19 C28 = CAP_POLSMC_A: PARTNO: *; +: +
FPGAUSB = CONN_USB: USB connector; PARTNO: *; USB: USB
IC1 = FT2232H: DUAL HIGH SPEED USB TO MULTIPURPOSE UART/FIFO IC; PARTNO: *
R23-R30 = RESISTORR603: PARTNO: *
U3 = DIGITAL-EEPROM-MICROWIRE-6P_SOT23: PARTNO: *
X1 = CRYSTAL_212M_: PARTNO: *
L3 L4 = FERRITE_BEAD603: NAME: *; PARTNO: *
RX TX = LED805: PARTNO: *

## Sheet Papilio_DUO_3.SchDoc: Papilio_DUO
size 423 x 288 mm; Date: 05/10/2018 09:53:59 p.m.; Organization: INVAP S.E.; Address1: Argentina; Address2: Rio Negro; Address3: Bariloche; Address4: Cte. Luis Piedra Buena 4950; SheetNumber: 4; DATABASE: C:/Dropbox/GadgetFactory/GadgetFactory_Engineering/Libraries/GadgetFactory-PARTSDB.txt; Rule: PcbType=ProtelPcb
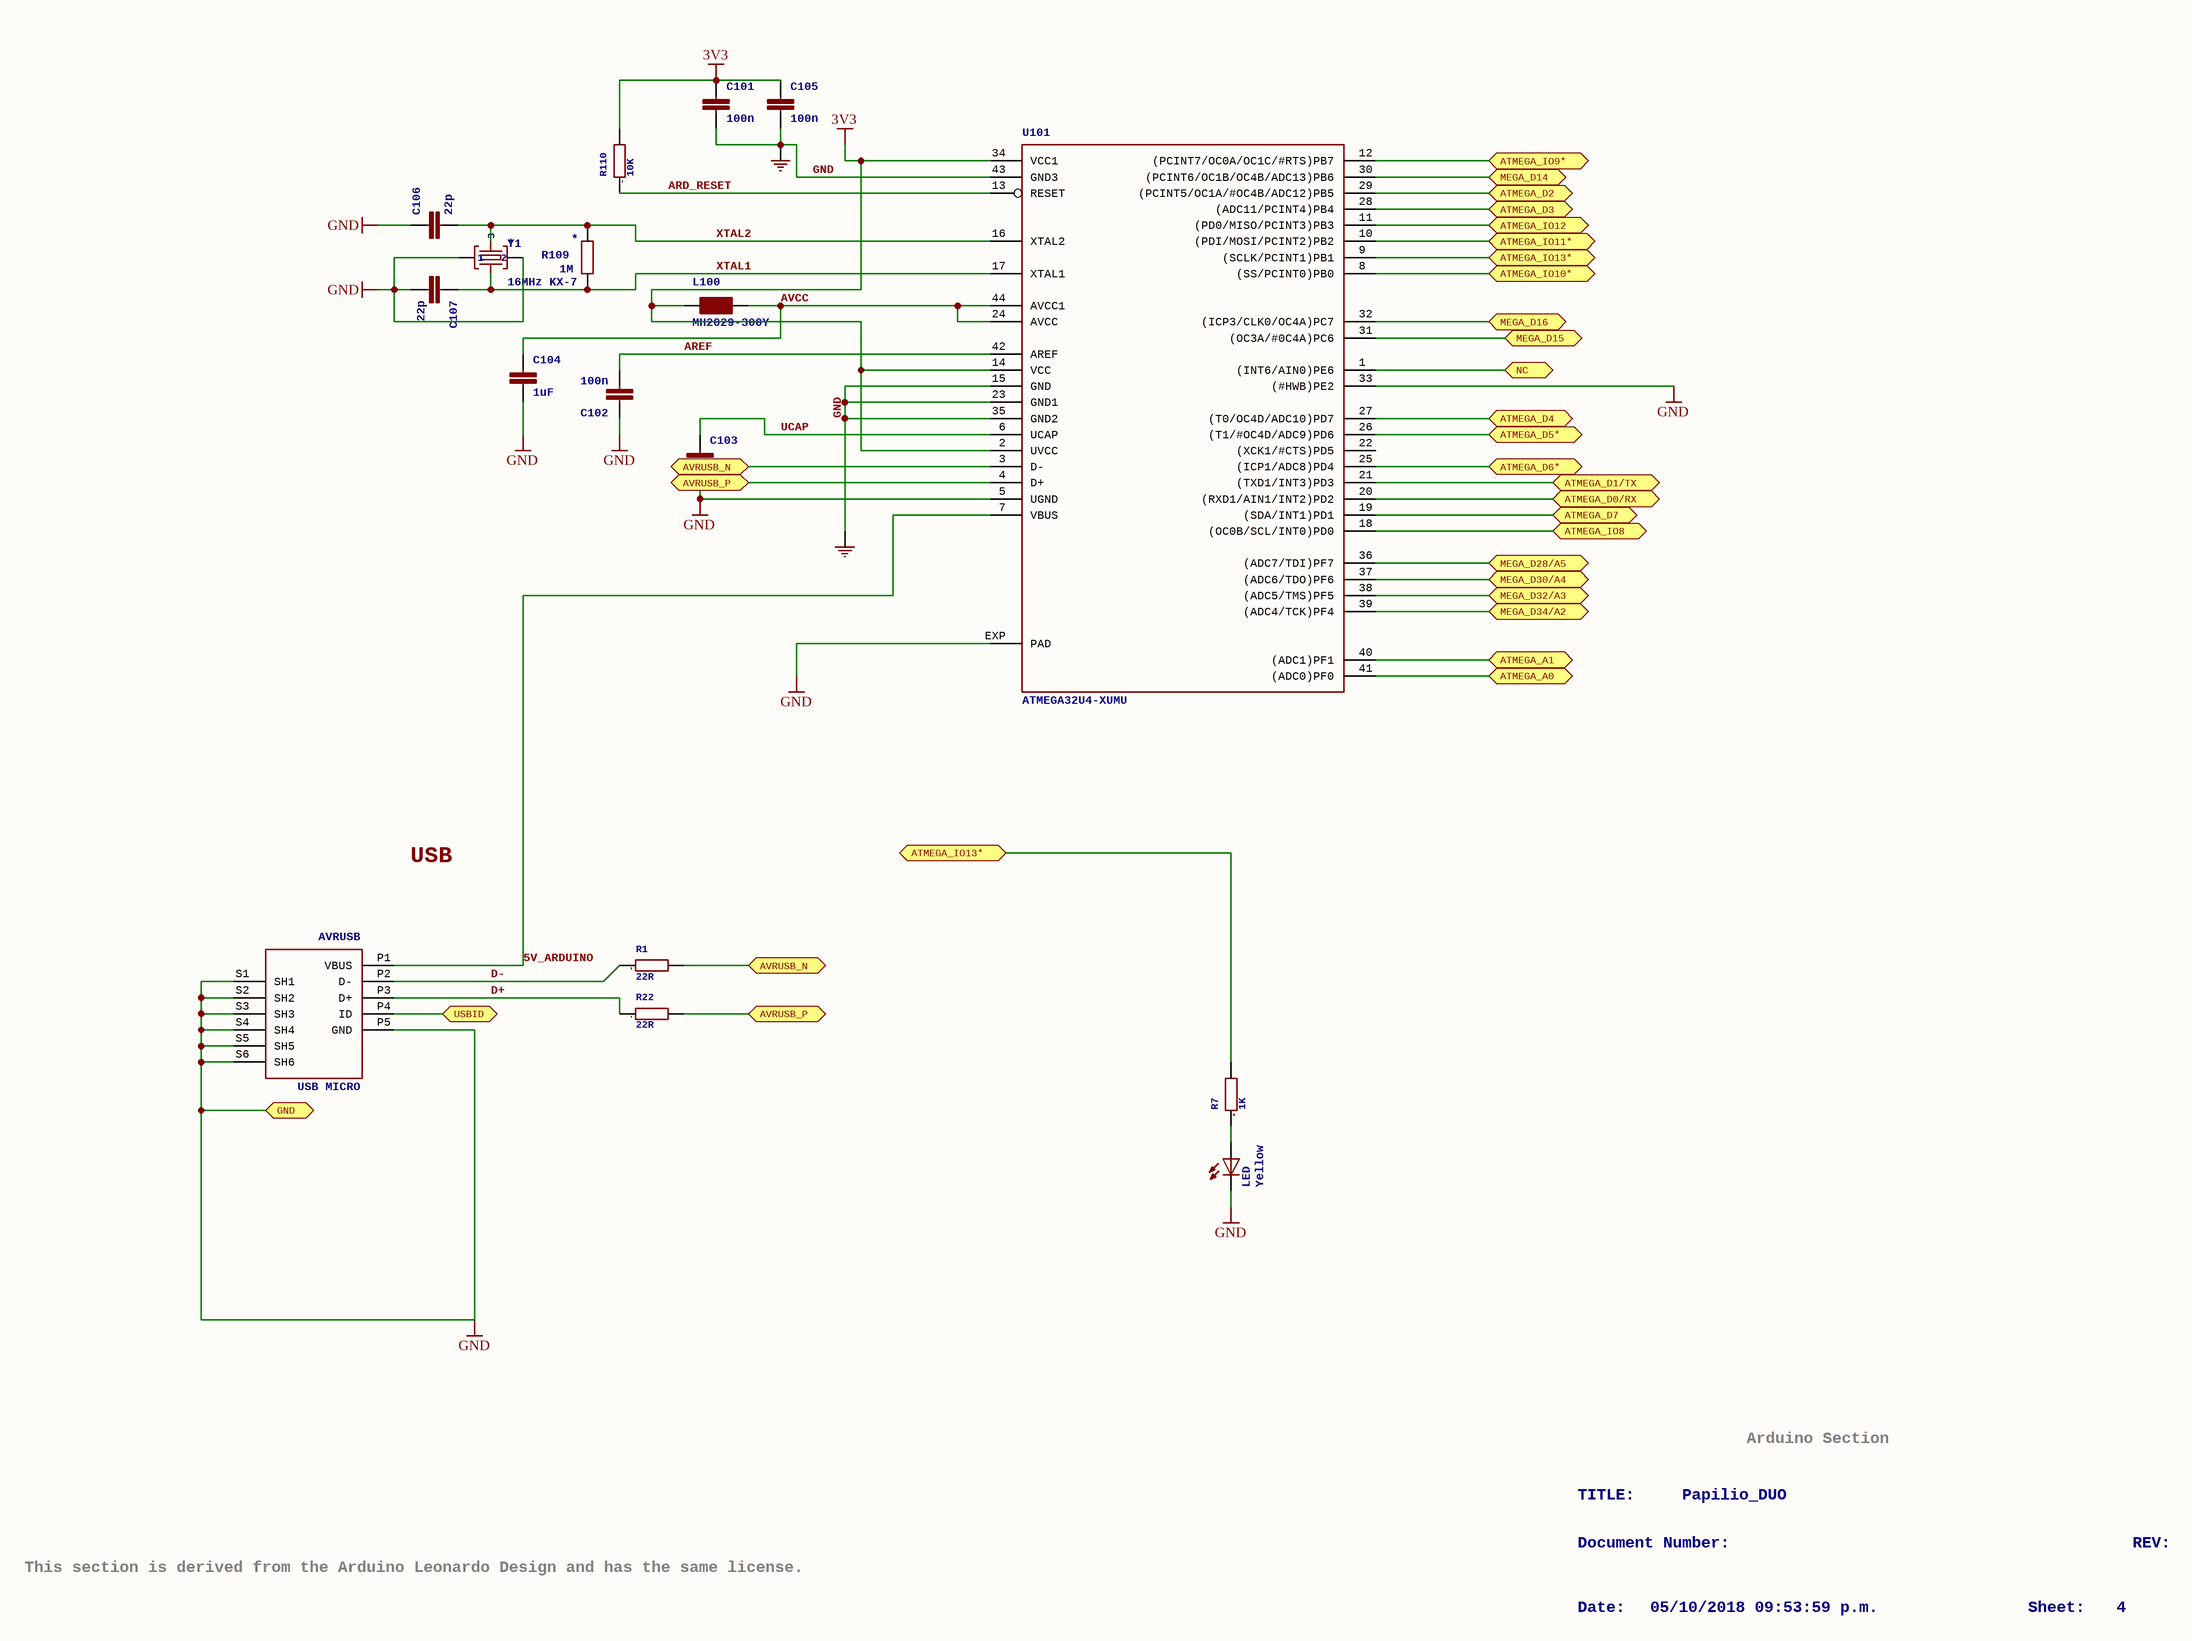
[diagram p7: Papilio_DUO_3.SchDoc]

### Parts
AVRUSB  USB MICRO  [CON2_USB_MICRO_B_AT]
C101  100n  [C0603K]
C102  100n  [C0603K]
C103  1uF  [C0603K]
C104  1uF  [C0603K]
C105  100n  [C0603K]
C106  22p  [C0603K]
C107  22p  [C0603K]
L100  MH2029-300Y  [0805]
LED  Yellow  [CHIPLED_0805]
R1  22R  [0805]
R7  1K  [0603]
R22  22R  [0805]
R109  1M  [R0603-ROUND]
R110  10K  [0603]
U101  ATMEGA32U4-XUMU  [QFN44ML7X7]
U$30  COM  (value not drawn)
U$40  COM  (value not drawn)
Y1  16MHz KX-7  [CRYSTAL-3.2-2.5]

### Ports
ATMEGA_A0, ATMEGA_A1, ATMEGA_D0/RX, ATMEGA_D1/TX, ATMEGA_D2, ATMEGA_D3, ATMEGA_D4, ATMEGA_D5*, ATMEGA_D6*, ATMEGA_D7, ATMEGA_IO8, ATMEGA_IO9*, ATMEGA_IO10*, ATMEGA_IO11*, ATMEGA_IO12, ATMEGA_IO13*, AVRUSB_N, AVRUSB_P, GND, MEGA_D14, MEGA_D15, MEGA_D16, MEGA_D28/A5, MEGA_D30/A4, MEGA_D32/A3, MEGA_D34/A2, NC, USBID

### Nets
3V3: C101.1 C105.1 L100.1 R110.2 U101.2(UVCC) U101.14(VCC) U101.34(VCC1)
GND: AVRUSB.P5(GND) AVRUSB.S1(SH1) AVRUSB.S2(SH2) AVRUSB.S3(SH3) AVRUSB.S4(SH4) AVRUSB.S5(SH5) AVRUSB.S6(SH6) C101.2 C102.1 C103.2 C104.2 C105.2 C106.1 C107.2 LED.C U101.5(UGND) U101.15(GND) U101.23(GND1) U101.33((#HWB)PE2) U101.35(GND2) U101.43(GND3) U101.EXP(PAD) U$30.?1(COM) U$40.?1(COM) Y1.2(GND) Y1.4(GND) ; port GND
5V_ARDUINO: AVRUSB.P1(VBUS) U101.7(VBUS)
ARD_RESET: R110.1 U101.13(RESET)
AREF: C102.2 U101.42(AREF)
AVCC: C104.1 L100.2 U101.24(AVCC) U101.44(AVCC1)
BD2_MPSSE_TDO: U101.32((ICP3/CLK0/OC4A)PC7) ; port MEGA_D16
BD3_MPSSE_TMS: U101.30((PCINT6/OC1B/OC4B/ADC13)PB6) ; port MEGA_D14
D+: AVRUSB.P3(D+) R22.1
D-: AVRUSB.P2(D-) R1.1
UCAP: C103.1 U101.6(UCAP)
XTAL1: C107.1 R109.1 U101.17(XTAL1) Y1.1(C1)
XTAL2: C106.2 R109.2 U101.16(XTAL2) Y1.3(C2)
NetAVRUSB_P4: AVRUSB.P4(ID) ; port USBID
NetIC1_43: U101.31((OC3A/#0C4A)PC6) ; port MEGA_D15
NetLED_A: LED.A R7.1
NetR1_2: R1.2 U101.3(D-) ; port AVRUSB_N
NetR7_2: R7.2 U101.9((SCLK/PCINT1)PB1) ; port ATMEGA_IO13*
NetR22_2: R22.2 U101.4(D+) ; port AVRUSB_P
NetS1_81: U101.39((ADC4/TCK)PF4) ; port MEGA_D34/A2
NetS1_83: U101.38((ADC5/TMS)PF5) ; port MEGA_D32/A3
NetS1_85: U101.37((ADC6/TDO)PF6) ; port MEGA_D30/A4
NetS1_88: U101.36((ADC7/TDI)PF7) ; port MEGA_D28/A5
NetU1_A0: U101.41((ADC0)PF0) ; port ATMEGA_A0
NetU1_A1: U101.40((ADC1)PF1) ; port ATMEGA_A1
NetU101_1: U101.1((INT6/AIN0)PE6) ; port NC
NetU101_8: U101.8((SS/PCINT0)PB0) ; port ATMEGA_IO10*
NetU101_10: U101.10((PDI/MOSI/PCINT2)PB2) ; port ATMEGA_IO11*
NetU101_11: U101.11((PD0/MISO/PCINT3)PB3) ; port ATMEGA_IO12
NetU101_12: U101.12((PCINT7/OC0A/OC1C/#RTS)PB7) ; port ATMEGA_IO9*
NetU101_18: U101.18((OC0B/SCL/INT0)PD0) ; port ATMEGA_IO8
NetU101_19: U101.19((SDA/INT1)PD1) ; port ATMEGA_D7
NetU101_20: U101.20((RXD1/AIN1/INT2)PD2) ; port ATMEGA_D0/RX
NetU101_21: U101.21((TXD1/INT3)PD3) ; port ATMEGA_D1/TX
NetU101_25: U101.25((ICP1/ADC8)PD4) ; port ATMEGA_D6*
NetU101_26: U101.26((T1/#OC4D/ADC9)PD6) ; port ATMEGA_D5*
NetU101_27: U101.27((T0/OC4D/ADC10)PD7) ; port ATMEGA_D4
NetU101_28: U101.28((ADC11/PCINT4)PB4) ; port ATMEGA_D3
NetU101_29: U101.29((PCINT5/OC1A/#OC4B/ADC12)PB5) ; port ATMEGA_D2

Not connected (* = marked no-connect by the designer): U101 22((XCK1/#CTS)PD5)

### Notes on the sheet
- USB
- Arduino Section
- TITLE:
- Document Number:
- Papilio_DUO
- REV:
- This section is derived from the Arduino Leonardo Design and has the same license.
- Date:
- 05/10/2018 09:53:59 p.m.
- Sheet:
- 4
- Título:
- Nº
- Hoja:
- de:
- Escala:
- *

### Library data of the parts
AVRUSB = MYCON2_USB-MINI-B: PARTNO: *
C101-C107 = C-EUC0603K: CAPACITOR, European symbol; PARTNO: *
L100 = WE-CBF_0805: SMD EMI Suppression Ferrite Beads - excellent anti-EMI properties - low DCR - impedances till 3000 ohms - rated current up to 6 A; PARTNO: *
LED = LEDCHIPLED_0805: LED   OSRAM: - CHIPLED LG R971, LG N971, LY N971, LG Q971, LY Q971, LO R971, LY R971 LH N974, LH R974 LS Q976, LO Q976, LY Q976 LO Q996 - Hyper CHIPLED LW Q18S LB Q993, LB Q99A, LB R99A - SideLED LS A670, LO A670, LY A670, LG A670, LP A670 LB A673, LV A673, LT A673, LW A673 LH A674 LY A675 LS A676, LA A676, LO A676, LY A676, LW A676 LS A679, LY A679, LG A679 -  Hyper Micro SIDELEDï¿½ LS Y876, LA Y876, LO Y876, LY Y876 LT Y87S - SmartLED LW L88C, LW L88S LB L89C, LB L89S, LG L890 LS L89K, LO L89K, LY L89K LS L896, LA L896, LO L896, LY L896 - TOPLED LS T670, LO T670, LY T670, LG T670, LP T670 LSG T670, LSP T670, LSY T670, LOP T670, LYG T670 LG T671, LOG T671, LSG T671 LB T673, LV T673, LT T673, LW T673 LH T674 LS T676, LA T676, LO T676, LY T676, LB T676, LH T676, LSB T676, LW T676 LB T67C, LV T67C, LT T67C, LS T67K, LO T67K, LY T67K, LW E67C LS E67B, LA E67B, LO E67B, LY E67B, LB E67C, LV E67C, LT E67C LW T67C LS T679, LY T679, LG T679 LS T770, LO T770, LY T770, LG T770, LP T770 LB T773, LV T773, LT T773, LW T773 LH T774 LS E675, LA E675, LY E675, LS T675 LS T776, LA T776, LO T776, LY T776, LB T776 LHGB T686 LT T68C, LB T68C - Hyper Mini TOPLEDï¿½ LB M676 - Mini TOPLED Santanaï¿½ LG M470 LS M47K, LO M47K, LY M47K    Source: http://www.osram.convergy.de   LUXEON: - LUMILEDï¿½ LXK2-PW12-R00, LXK2-PW12-S00, LXK2-PW14-U00, LXK2-PW14-V00 LXK2-PM12-R00, LXK2-PM12-S00, LXK2-PM14-U00 LXK2-PE12-Q00, LXK2-PE12-R00, LXK2-PE12-S00, LXK2-PE14-T00, LXK2-PE14-U00 LXK2-PB12-K00, LXK2-PB12-L00, LXK2-PB12-M00, LXK2-PB14-N00, LXK2-PB14-P00, LXK2-PB14-Q00 LXK2-PR12-L00, LXK2-PR12-M00, LXK2-PR14-Q00, LXK2-PR14-R00 LXK2-PD12-Q00, LXK2-PD12-R00, LXK2-PD12-S00 LXK2-PH12-R00, LXK2-PH12-S00 LXK2-PL12-P00, LXK2-PL12-Q00, LXK2-PL12-R00    Source: www.luxeon.com   KINGBRIGHT:   KA-3528ASYC Source: www.kingbright.com; PARTNO: *
R1 R22 = R0805: RESISTOR, European symbol; PARTNO: *
R7 R110 = R0603: RESISTOR, European symbol; PARTNO: *
R109 = R-EU_R0603: RESISTOR, European symbol; NAME: *; PARTNO: *
Y1 = CRYSTAL-3.2-2.5: NAME: *; PARTNO: *; 1: 1; 2: 2; 3: 3
U101 = ATMEGA32U4-XUMU: PARTNO: *

## Nets that join several sheets
1V2: Papilio_DUO_0 (9 pins), Papilio_DUO_1 (C2.2 L2.2 R5.2)
3V3: Papilio_DUO_0 (49 pins), Papilio_DUO_1 (C1.2 L1.2 R2.2 U2.9), Papilio_DUO_2 (19 pins), Papilio_DUO_3 (7 pins)
5V0: Papilio_DUO_0 (9 pins), Papilio_DUO_1 (C3.2 U2.2 U2.3 U2.7)
GND: Papilio_DUO_0 (52 pins), Papilio_DUO_1 (9 pins), Papilio_DUO_2 (28 pins), Papilio_DUO_3 (26 pins)
BD2_MPSSE_TDO: Papilio_DUO_0 (S1.112 S1.140 U1.D16), Papilio_DUO_3 (U101.32)
BD3_MPSSE_TMS: Papilio_DUO_0 (17 pins), Papilio_DUO_3 (U101.30)
NetFPGAUSB_VUSB: Papilio_DUO_1 (PWRSEL.1), Papilio_DUO_2 (FPGAUSB.VUSB)
NetIC1_16: Papilio_DUO_0 (S1.109 U$1.JTAG_TCK), Papilio_DUO_2 (IC1.16)
NetIC1_17: Papilio_DUO_0 (S1.110 U$1.JTAG_TDI), Papilio_DUO_2 (IC1.17)
NetIC1_18: Papilio_DUO_0 (S1.106 U$1.JTAG_TDO), Papilio_DUO_2 (IC1.18)
NetIC1_19: Papilio_DUO_0 (S1.107 U$1.JTAG_TMS), Papilio_DUO_2 (IC1.19)
NetIC1_21: Papilio_DUO_0 (S1.45), Papilio_DUO_2 (IC1.21)
NetIC1_38: Papilio_DUO_0 (S1.46), Papilio_DUO_2 (IC1.38)
NetIC1_43: Papilio_DUO_0 (5 pins), Papilio_DUO_2 (IC1.43), Papilio_DUO_3 (U101.31)
NetS1_81: Papilio_DUO_0 (S1.81 U1.A2 U1.D34), Papilio_DUO_3 (U101.39)
NetS1_83: Papilio_DUO_0 (S1.83 U1.A3 U1.D32), Papilio_DUO_3 (U101.38)
NetS1_85: Papilio_DUO_0 (S1.85 U1.A4 U1.D30), Papilio_DUO_3 (U101.37)
NetS1_88: Papilio_DUO_0 (S1.88 U1.A5 U1.D28), Papilio_DUO_3 (U101.36)
NetU1_A0: Papilio_DUO_0 (U1.A0), Papilio_DUO_3 (U101.41)
NetU1_A1: Papilio_DUO_0 (U1.A1), Papilio_DUO_3 (U101.40)